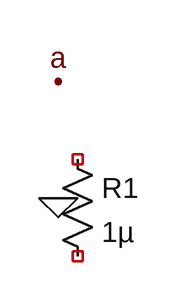
[diagram p0: schematic micro_utf8.asc]
micro_utf8.asc, the LTspice schematic file:
Version 4.1
SHEET 1 880 680
FLAG 96 96 a
FLAG 96 192 0
SYMBOL res 96 144 R0
SYMATTR InstName R1
SYMATTR Value 1µ

The netlist it stands for:
* micro_utf8.asc
R1 NC_01 NC_02 1µ
.backanno
.end